# Altium schematic sheet CPU IO.SchDoc: CPU IO
size A2; DrawnBy: UKAYACIK; Engineer: UKAYACIK; DocumentNumber: 7; Revision: B; SheetNumber: 8; SheetTotal: 21
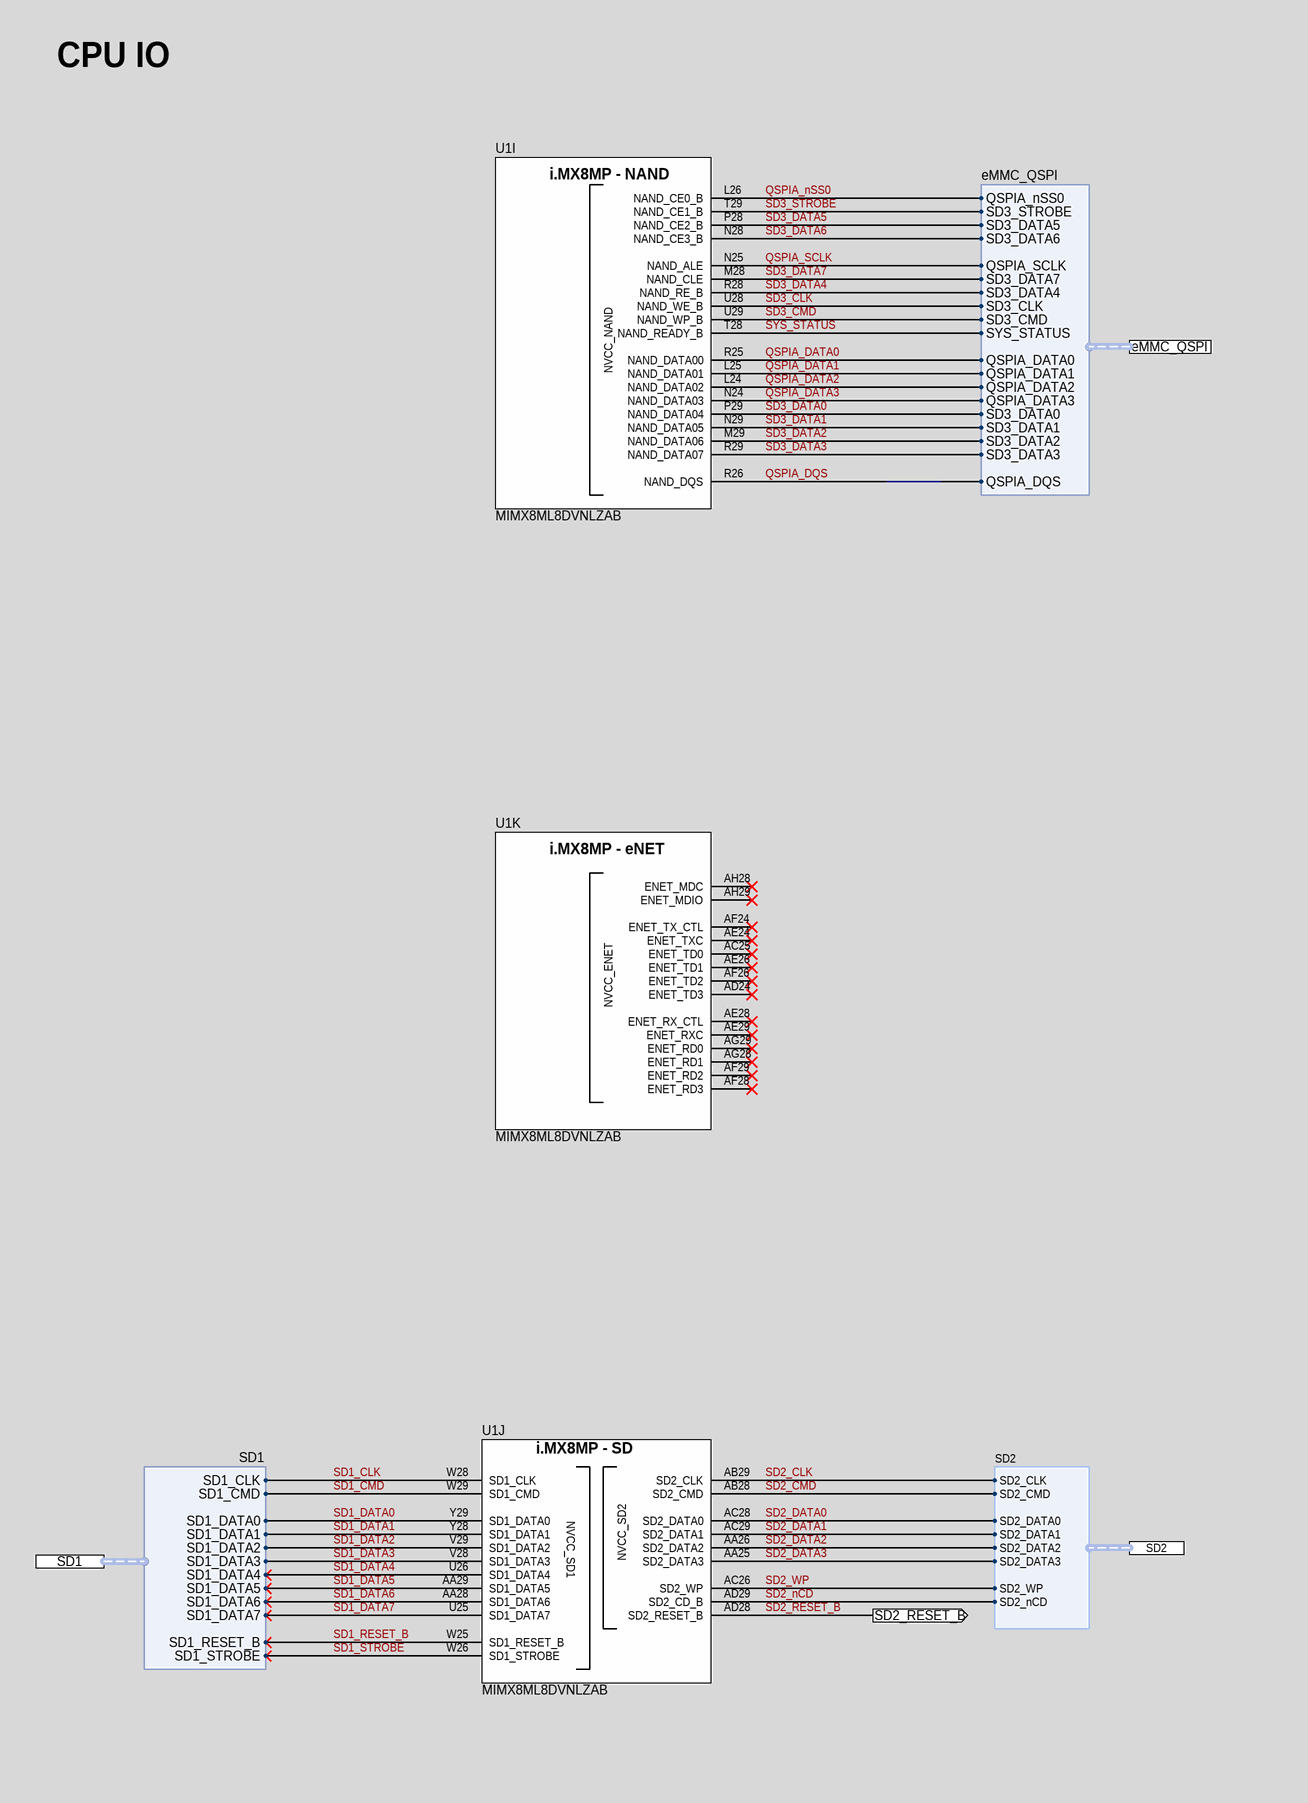
[diagram p0: CPU IO.SchDoc, left]
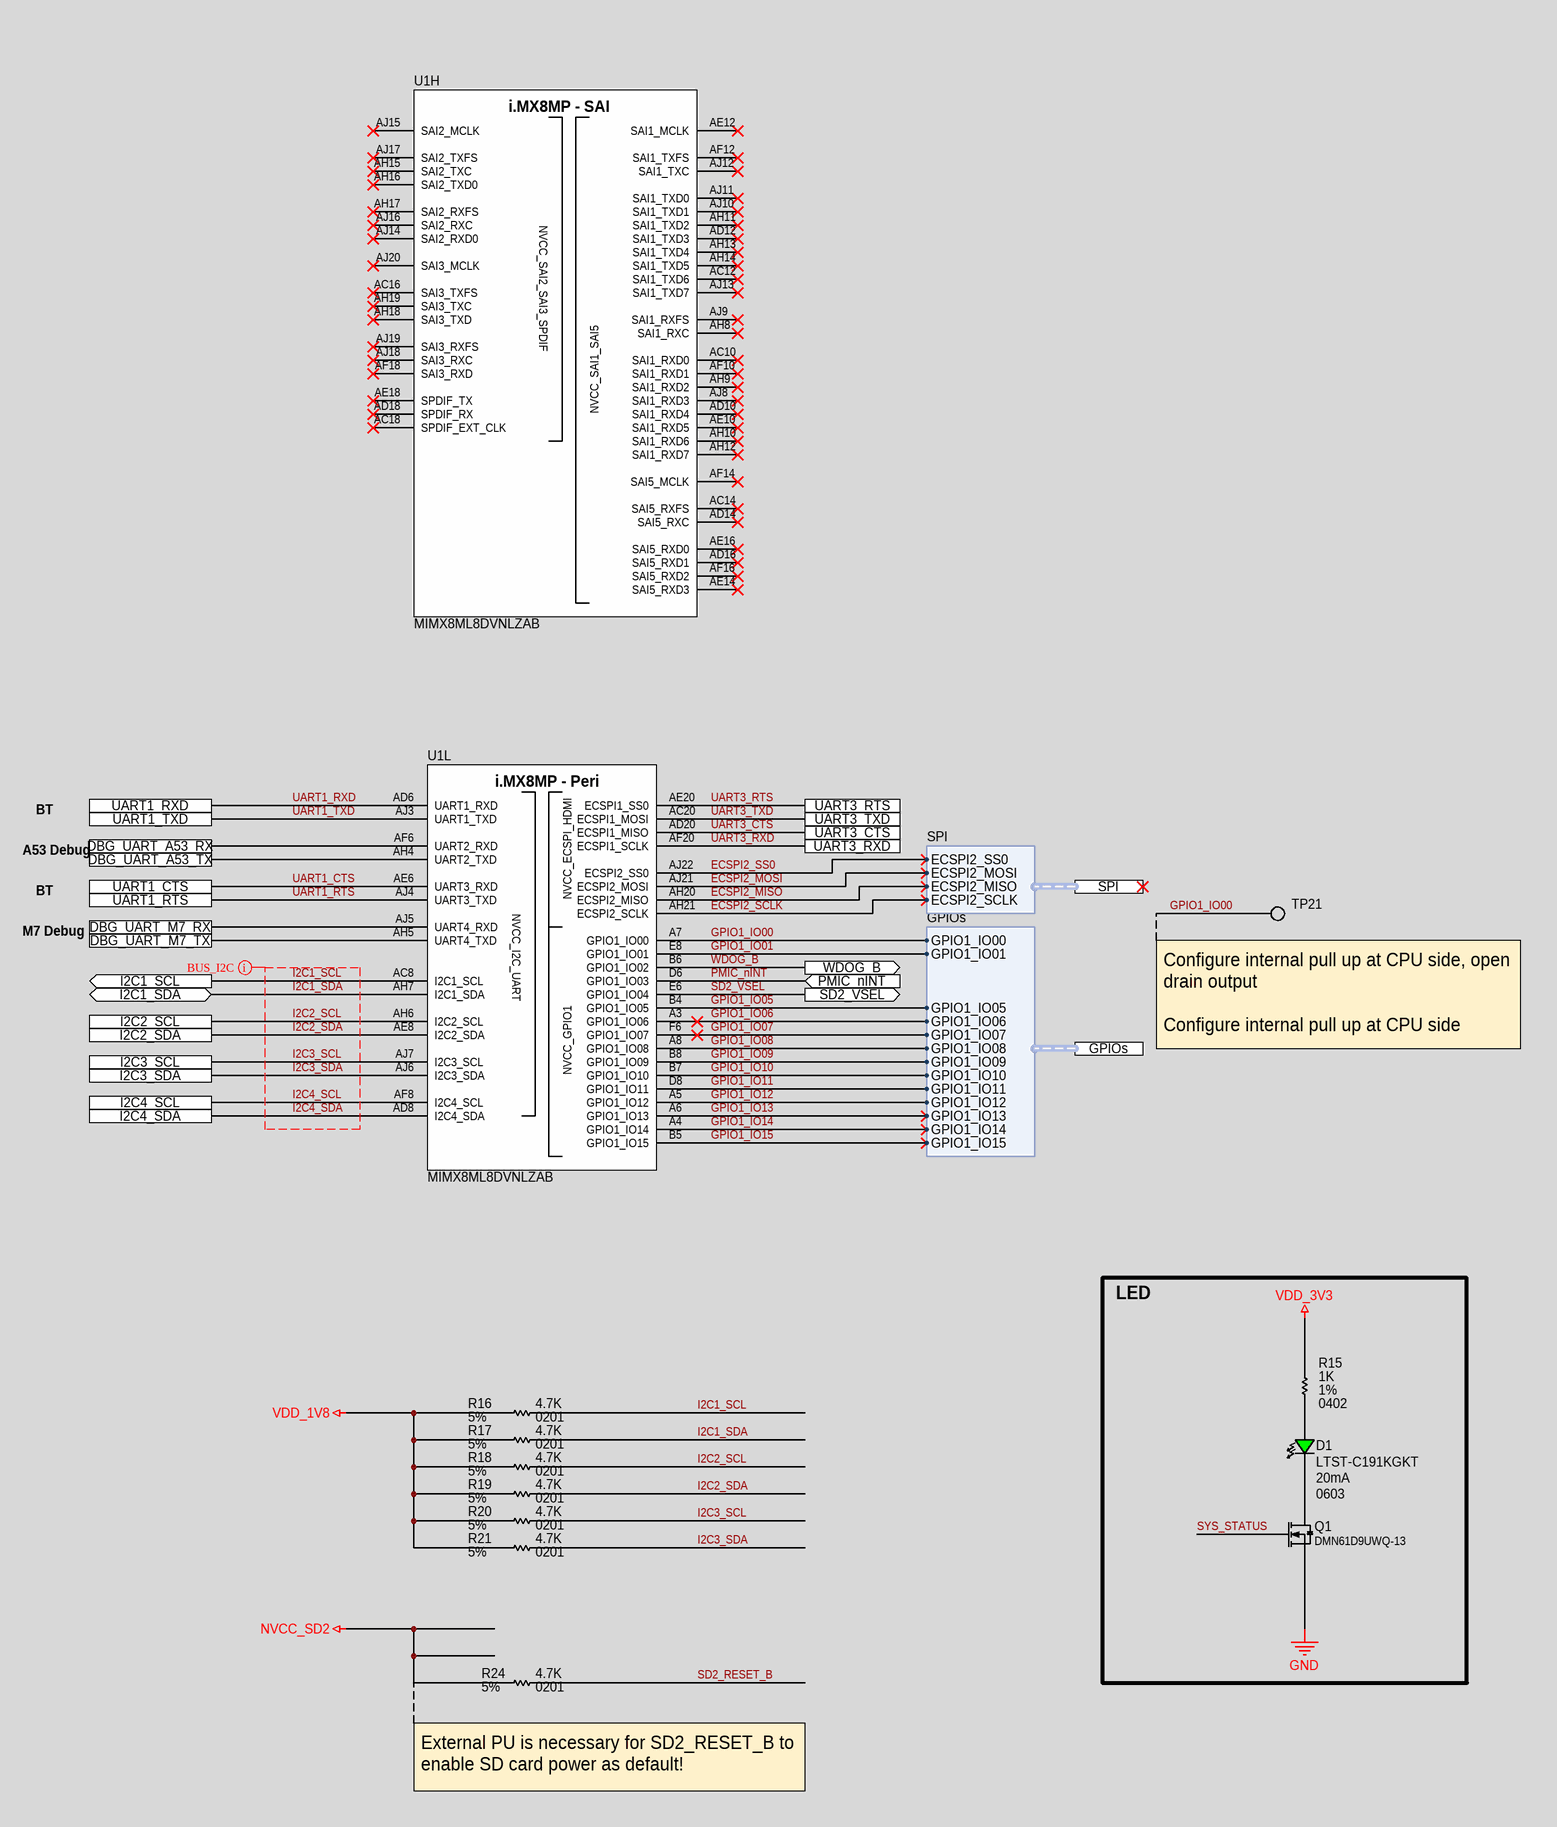
[diagram p1: CPU IO.SchDoc, right]

## Parts
D1  LTST-C191KGKT  Test Current: 20mA  Case/Package: 0603  [LED_0603-GREEN]
Q1  DMN61D9UWQ-13  [SOT-323]
R15  Resistance: 1K  Tolerance: 1%  Case/Package: 0402  [RES_0402_RESC1005X04N]  (hidden comment: ERJ-2RKF1001X)
R16  Tolerance: 5%  Resistance: 4.7K  Case/Package: 0201  [RES_0201_RESC0603X02N]  (hidden comment: RK73B1HTTC472J)
R17  Tolerance: 5%  Resistance: 4.7K  Case/Package: 0201  [RES_0201_RESC0603X02N]  (hidden comment: RK73B1HTTC472J)
R18  Tolerance: 5%  Resistance: 4.7K  Case/Package: 0201  [RES_0201_RESC0603X02N]  (hidden comment: RK73B1HTTC472J)
R19  Tolerance: 5%  Resistance: 4.7K  Case/Package: 0201  [RES_0201_RESC0603X02N]  (hidden comment: RK73B1HTTC472J)
R20  Tolerance: 5%  Resistance: 4.7K  Case/Package: 0201  [RES_0201_RESC0603X02N]  (hidden comment: RK73B1HTTC472J)
R21  Tolerance: 5%  Resistance: 4.7K  Case/Package: 0201  [RES_0201_RESC0603X02N]  (hidden comment: RK73B1HTTC472J)
R24  Tolerance: 5%  Resistance: 4.7K  Case/Package: 0201  [RES_0201_RESC0603X02N]  (hidden comment: RK73B1HTTC472J)
TP21  NO COMPONENT  [TP_PAD_0.5MM_SMD_ROUND]  (value not drawn)  (no BOM)
U1  MIMX8ML8DVNLZAB  [IC_MPU_BGA548C50P29X29_1500X1500X148]  (parts H,I,J,K,L of 15)

## Blocks framed on the sheet
LED: D1 Q1 R15

## Ports
DBG_UART_A53_RX, DBG_UART_A53_TX, DBG_UART_M7_RX, DBG_UART_M7_TX, eMMC_QSPI (harness eMMC_QSPI), GPIOs (harness GPIOs), I2C1_SCL (out), I2C1_SDA (bidir), I2C2_SCL, I2C2_SDA, I2C3_SCL, I2C3_SDA, I2C4_SCL, I2C4_SDA, PMIC_nINT (in), SD1 (harness SD1), SD2 (harness SD2), SD2_RESET_B (out), SD2_VSEL (out), SPI (harness SPI), UART1_CTS, UART1_RTS, UART1_RXD, UART1_TXD, UART3_CTS, UART3_RTS, UART3_RXD, UART3_TXD, WDOG_B (out)

## Harnesses
eMMC_QSPI: SD3_STROBE, SD3_DATA5, SD3_DATA6, SD3_DATA7, SD3_DATA4, SD3_CLK, SD3_CMD, SYS_STATUS, QSPIA_DATA0, QSPIA_DATA1, QSPIA_DATA2, QSPIA_DATA3, QSPIA_nSS0, SD3_DATA0, QSPIA_SCLK, SD3_DATA1, SD3_DATA2, SD3_DATA3, QSPIA_DQS
SD1: SD1_CMD, SD1_DATA0, SD1_DATA1, SD1_DATA2, SD1_DATA3, SD1_DATA4, SD1_DATA6, SD1_DATA7, SD1_RESET_B, SD1_STROBE, SD1_CLK, SD1_DATA5
GPIOs: GPIO1_IO00, GPIO1_IO01, GPIO1_IO05, GPIO1_IO06, GPIO1_IO07, GPIO1_IO08, GPIO1_IO09, GPIO1_IO10, GPIO1_IO11, GPIO1_IO12, GPIO1_IO13, GPIO1_IO14, GPIO1_IO15
SPI: ECSPI2_SS0, ECSPI2_MOSI, ECSPI2_MISO, ECSPI2_SCLK
SD2: SD2_CLK, SD2_CMD, SD2_DATA0, SD2_DATA1, SD2_DATA2, SD2_DATA3, SD2_WP, SD2_nCD

## Nets
GND: Q1.S
NVCC_SD2: R24.1
VDD_1V8: R16.1 R17.1 R18.1 R19.1 R20.1 R21.1
VDD_3V3: R15.2
DBG_UART_A53_RX: U1.AF6(UART2_RXD) ; port DBG_UART_A53_RX
DBG_UART_A53_TX: U1.AH4(UART2_TXD) ; port DBG_UART_A53_TX
DBG_UART_M7_RX: U1.AJ5(UART4_RXD) ; port DBG_UART_M7_RX
DBG_UART_M7_TX: U1.AH5(UART4_TXD) ; port DBG_UART_M7_TX
ECSPI2_MISO: U1.AH20(ECSPI2_MISO) ; port SPI.ECSPI2_MISO
ECSPI2_MOSI: U1.AJ21(ECSPI2_MOSI) ; port SPI.ECSPI2_MOSI
ECSPI2_SCLK: U1.AH21(ECSPI2_SCLK) ; port SPI.ECSPI2_SCLK
ECSPI2_SS0: U1.AJ22(ECSPI2_SS0) ; port SPI.ECSPI2_SS0
GPIO1_IO00: TP21.1 U1.A7(GPIO1_IO00) ; port GPIOs.GPIO1_IO00
GPIO1_IO01: U1.E8(GPIO1_IO01) ; port GPIOs.GPIO1_IO01
GPIO1_IO05: U1.B4(GPIO1_IO05) ; port GPIOs.GPIO1_IO05
GPIO1_IO06: U1.A3(GPIO1_IO06) ; port GPIOs.GPIO1_IO06
GPIO1_IO07: U1.F6(GPIO1_IO07) ; port GPIOs.GPIO1_IO07
GPIO1_IO08: U1.A8(GPIO1_IO08) ; port GPIOs.GPIO1_IO08
GPIO1_IO09: U1.B8(GPIO1_IO09) ; port GPIOs.GPIO1_IO09
GPIO1_IO10: U1.B7(GPIO1_IO10) ; port GPIOs.GPIO1_IO10
GPIO1_IO11: U1.D8(GPIO1_IO11) ; port GPIOs.GPIO1_IO11
GPIO1_IO12: U1.A5(GPIO1_IO12) ; port GPIOs.GPIO1_IO12
GPIO1_IO13: U1.A6(GPIO1_IO13) ; port GPIOs.GPIO1_IO13
GPIO1_IO14: U1.A4(GPIO1_IO14) ; port GPIOs.GPIO1_IO14
GPIO1_IO15: U1.B5(GPIO1_IO15) ; port GPIOs.GPIO1_IO15
I2C1_SCL: R16.2 U1.AC8(I2C1_SCL) ; port I2C1_SCL
I2C1_SDA: R17.2 U1.AH7(I2C1_SDA) ; port I2C1_SDA
I2C2_SCL: R18.2 U1.AH6(I2C2_SCL) ; port I2C2_SCL
I2C2_SDA: R19.2 U1.AE8(I2C2_SDA) ; port I2C2_SDA
I2C3_SCL: R20.2 U1.AJ7(I2C3_SCL) ; port I2C3_SCL
I2C3_SDA: R21.2 U1.AJ6(I2C3_SDA) ; port I2C3_SDA
I2C4_SCL: U1.AF8(I2C4_SCL) ; port I2C4_SCL
I2C4_SDA: U1.AD8(I2C4_SDA) ; port I2C4_SDA
PMIC_nINT: U1.D6(GPIO1_IO03) ; port PMIC_nINT
QSPIA_DATA0: U1.R25(NAND_DATA00) ; port eMMC_QSPI.QSPIA_DATA0
QSPIA_DATA1: U1.L25(NAND_DATA01) ; port eMMC_QSPI.QSPIA_DATA1
QSPIA_DATA2: U1.L24(NAND_DATA02) ; port eMMC_QSPI.QSPIA_DATA2
QSPIA_DATA3: U1.N24(NAND_DATA03) ; port eMMC_QSPI.QSPIA_DATA3
QSPIA_DQS: U1.R26(NAND_DQS) ; port eMMC_QSPI.QSPIA_DQS
QSPIA_nSS0: U1.L26(NAND_CE0_B) ; port eMMC_QSPI.QSPIA_nSS0
QSPIA_SCLK: U1.N25(NAND_ALE) ; port eMMC_QSPI.QSPIA_SCLK
SD1_CLK: U1.W28(SD1_CLK) ; port SD1.SD1_CLK
SD1_CMD: U1.W29(SD1_CMD) ; port SD1.SD1_CMD
SD1_DATA0: U1.Y29(SD1_DATA0) ; port SD1.SD1_DATA0
SD1_DATA1: U1.Y28(SD1_DATA1) ; port SD1.SD1_DATA1
SD1_DATA2: U1.V29(SD1_DATA2) ; port SD1.SD1_DATA2
SD1_DATA3: U1.V28(SD1_DATA3) ; port SD1.SD1_DATA3
SD1_DATA4: U1.U26(SD1_DATA4) ; port SD1.SD1_DATA4
SD1_DATA5: U1.AA29(SD1_DATA5) ; port SD1.SD1_DATA5
SD1_DATA6: U1.AA28(SD1_DATA6) ; port SD1.SD1_DATA6
SD1_DATA7: U1.U25(SD1_DATA7) ; port SD1.SD1_DATA7
SD1_RESET_B: U1.W25(SD1_RESET_B) ; port SD1.SD1_RESET_B
SD1_STROBE: U1.W26(SD1_STROBE) ; port SD1.SD1_STROBE
SD2_CLK: U1.AB29(SD2_CLK) ; port SD2.SD2_CLK
SD2_CMD: U1.AB28(SD2_CMD) ; port SD2.SD2_CMD
SD2_DATA0: U1.AC28(SD2_DATA0) ; port SD2.SD2_DATA0
SD2_DATA1: U1.AC29(SD2_DATA1) ; port SD2.SD2_DATA1
SD2_DATA2: U1.AA26(SD2_DATA2) ; port SD2.SD2_DATA2
SD2_DATA3: U1.AA25(SD2_DATA3) ; port SD2.SD2_DATA3
SD2_nCD: U1.AD29(SD2_CD_B) ; port SD2.SD2_nCD
SD2_RESET_B: R24.2 U1.AD28(SD2_RESET_B) ; port SD2_RESET_B
SD2_VSEL: U1.E6(GPIO1_IO04) ; port SD2_VSEL
SD2_WP: U1.AC26(SD2_WP) ; port SD2.SD2_WP
SD3_CLK: U1.U28(NAND_WE_B) ; port eMMC_QSPI.SD3_CLK
SD3_CMD: U1.U29(NAND_WP_B) ; port eMMC_QSPI.SD3_CMD
SD3_DATA0: U1.P29(NAND_DATA04) ; port eMMC_QSPI.SD3_DATA0
SD3_DATA1: U1.N29(NAND_DATA05) ; port eMMC_QSPI.SD3_DATA1
SD3_DATA2: U1.M29(NAND_DATA06) ; port eMMC_QSPI.SD3_DATA2
SD3_DATA3: U1.R29(NAND_DATA07) ; port eMMC_QSPI.SD3_DATA3
SD3_DATA4: U1.R28(NAND_RE_B) ; port eMMC_QSPI.SD3_DATA4
SD3_DATA5: U1.P28(NAND_CE2_B) ; port eMMC_QSPI.SD3_DATA5
SD3_DATA6: U1.N28(NAND_CE3_B) ; port eMMC_QSPI.SD3_DATA6
SD3_DATA7: U1.M28(NAND_CLE) ; port eMMC_QSPI.SD3_DATA7
SD3_STROBE: U1.T29(NAND_CE1_B) ; port eMMC_QSPI.SD3_STROBE
SYS_STATUS: Q1.G U1.T28(NAND_READY_B) ; port eMMC_QSPI.SYS_STATUS
UART1_CTS: U1.AE6(UART3_RXD) ; port UART1_CTS
UART1_RTS: U1.AJ4(UART3_TXD) ; port UART1_RTS
UART1_RXD: U1.AD6(UART1_RXD) ; port UART1_RXD
UART1_TXD: U1.AJ3(UART1_TXD) ; port UART1_TXD
UART3_CTS: U1.AD20(ECSPI1_MISO) ; port UART3_CTS
UART3_RTS: U1.AE20(ECSPI1_SS0) ; port UART3_RTS
UART3_RXD: U1.AF20(ECSPI1_SCLK) ; port UART3_RXD
UART3_TXD: U1.AC20(ECSPI1_MOSI) ; port UART3_TXD
WDOG_B: U1.B6(GPIO1_IO02) ; port WDOG_B
NetD1_1: D1.1(C) Q1.D
NetD1_2: D1.2(A) R15.1

Not connected (* = marked no-connect by the designer): U1 AC10(SAI1_RXD0)* AC12(SAI1_TXD6)* AC14(SAI5_RXFS)* AC16(SAI3_TXFS)* AC18(SPDIF_EXT_CLK)* AC25(ENET_TD0)* AD10(SAI1_RXD4)* AD12(SAI1_TXD3)* AD14(SAI5_RXC)* AD16(SAI5_RXD1)* AD18(SPDIF_RX)* AD24(ENET_TD3)* AE10(SAI1_RXD5)* AE12(SAI1_MCLK)* AE14(SAI5_RXD3)* AE16(SAI5_RXD0)* AE18(SPDIF_TX)* AE24(ENET_TXC)* AE26(ENET_TD1)* AE28(ENET_RX_CTL)* AE29(ENET_RXC)* AF10(SAI1_RXD1)* AF12(SAI1_TXFS)* AF14(SAI5_MCLK)* AF16(SAI5_RXD2)* AF18(SAI3_RXD)* AF24(ENET_TX_CTL)* AF26(ENET_TD2)* AF28(ENET_RD3)* AF29(ENET_RD2)* AG28(ENET_RD1)* AG29(ENET_RD0)* AH8(SAI1_RXC)* AH9(SAI1_RXD2)* AH10(SAI1_RXD6)* AH11(SAI1_TXD2)* AH12(SAI1_RXD7)* AH13(SAI1_TXD4)* AH14(SAI1_TXD5)* AH15(SAI2_TXC)* AH16(SAI2_TXD0)* AH17(SAI2_RXFS)* AH18(SAI3_TXD)* AH19(SAI3_TXC)* AH28(ENET_MDC)* AH29(ENET_MDIO)* AJ8(SAI1_RXD3)* AJ9(SAI1_RXFS)* AJ10(SAI1_TXD1)* AJ11(SAI1_TXD0)* AJ12(SAI1_TXC)* AJ13(SAI1_TXD7)* AJ14(SAI2_RXD0)* AJ15(SAI2_MCLK)* AJ16(SAI2_RXC)* AJ17(SAI2_TXFS)* AJ18(SAI3_RXC)* AJ19(SAI3_RXFS)* AJ20(SAI3_MCLK)*

## Layout directives
net class I2C: I2C1_SCL, I2C1_SDA, I2C2_SCL, I2C2_SDA, I2C3_SCL, I2C3_SDA, I2C4_SCL, I2C4_SDA

## Notes on the sheet
- CPU IO
- BT
- A53 Debug
- M7 Debug
- (near TP21) Configure internal pull up at CPU side, open drain output
  Configure internal pull up at CPU side
- (near Q1) Blink:  SYS_STATUS
- (near R24) External PU is necessary for SD2_RESET_B to enable SD card power as default!
- PCB Des :
- Approv By :
- Project Title :
- Sheet Title :
- Date :
- Page :
- PCB Version :
- PCB Revision :
- Size :
- A2
- (in symbol IC_MPU_8M_PLUS_MIMX8ML8DVNLZAB, part H) i.MX8MP - SAI
- (in symbol IC_MPU_8M_PLUS_MIMX8ML8DVNLZAB, part I) i.MX8MP - NAND
- (in symbol IC_MPU_8M_PLUS_MIMX8ML8DVNLZAB, part J) i.MX8MP - SD
- (in symbol IC_MPU_8M_PLUS_MIMX8ML8DVNLZAB, part K) i.MX8MP - eNET
- (in symbol IC_MPU_8M_PLUS_MIMX8ML8DVNLZAB, part L) i.MX8MP - Peri; NVCC_GPIO1

## Library data of the parts
D1 = LED_DIO_GREEN_20mA_0603: LTST-C191KGKT Lite-On LED, green, 18-71mcd, 130, 1.9V-2.4V SMD, 0603 1.6x0.8x0.55mm RoHS; Manufacturer: Vishay Lite-On; Lens Color: Colorless; Luminous Intensity: 35mcd; Viewing Angle: 130°; Forward Voltage: 2V; Dominant Wavelength: 571nm; Lens Transparency: Clear; Wavelength: 574nm; Lens Style: Flat,Rectangular,Colorless; Number of LEDs: 1; Max Power Dissipation: 75mW; Lens Size: 0.8mm; Supplier 1: Digi-Key; Manufacturer Part Number: LTST-C191KGKT; RoHS: Yes; Stock 1: 1556161; Pricing 1: 1=0.26, 10=0.143, 100=0.0663, 500=0.0612, 1000=0.04794, 2000=0.04693 (USD); Mount: Surface Mount; Number of Pins: 2; Color: Green; Case Code (Metric): 1608; Case Code (Imperial): 0603; Min Operating Temperature: -55°C; Max Operating Temperature: 85°C; Packaging: Tape and Reel; Series: -; Length: 1.6mm; Width: 0.8mm; Height: 0.65mm; RoHS Compliant: Yes; Lead Free: Lead Free; ComponentLink1URL: https://datasheet.ciiva.com/2109/ltst-c191kgkt-2109973.pdf?src-supplier=Digi-Key; ComponentLink1Description: https://datasheet.ciiva.com/2109/ltst-c191kgkt-2109973.pdf?src-supplier=Digi-Key; Supplier Part Number 1: 160-1446-1-ND
Q1 = TRANS_FET_CHA_N_60V_340mA: N-Channel Enhancement Mode MOSFET 60V 340mA 3-Pin SOT-323 T/R; Manufacturer: Diodes; Continuous Drain Current (ID): 400mA; Rds On Max: 2R; Input Capacitance: 28.5pF; Max Power Dissipation: 440mW; Supplier 1: Digi-Key; Manufacturer Part Number: DMN61D9UWQ-13; RoHS: Yes; Category: MOSFETs; Stock 1: 209235; Pricing 1: 1=0.35, 10=0.259, 100=0.1468, 500=0.0972, 1000=0.07452, 2000=0.0648, 5000=0.05832 (USD); Mount: Surface Mount; Case/Package: SOT-323; Min Operating Temperature: -55°C; Max Operating Temperature: 150°C; Packaging: Cut Tape; Drain to Source Voltage (Vdss): 60V; Series: -; RoHS Compliant: Yes; ComponentLink1URL: https://www.diodes.com/assets/Datasheets/DMN61D9UWQ.pdf?src-supplier=Digi-Key; ComponentLink1Description: https://www.diodes.com/assets/Datasheets/DMN61D9UWQ.pdf?src-supplier=Digi-Key; ComponentLink2URL: https://datasheet.octopart.com/DMN61D9UWQ-13-Diodes-Inc.-datasheet-151210411.pdf?src-supplier=Farnell; ComponentLink2Description: https://datasheet.octopart.com/DMN61D9UWQ-13-Diodes-Inc.-datasheet-151210411.pdf?src-supplier=Farnell; ComponentLink3URL: https://datasheet.octopart.com/DMN61D9UWQ-13-Diodes-Inc.-datasheet-165191130.pdf?src-supplier=Future+Electronics; ComponentLink3Description: https://datasheet.octopart.com/DMN61D9UWQ-13-Diodes-Inc.-datasheet-165191130.pdf?src-supplier=Future+Electronics; Supplier Part Number 1: DMN61D9UWQ-13DICT-ND
R15 = RES_1K_1%_100mW_0402: RES SMD 1K OHM 1% 1/10W 0402; Manufacturer: Panasonic; Temperature Coefficient: 100ppm/°C; Max Power Dissipation: 100mW; Voltage Rating (DC): 50V; Supplier 1: Digi-Key; Manufacturer Part Number: ERJ-2RKF1001X; RoHS: Yes; Category: Chip SMD Resistors; Stock 1: 2367361; Pricing 1: 1=0.1, 10=0.029, 50=0.0162, 100=0.0119, 500=0.00728, 1000=0.00535, 5000=0.00384 (USD); Mount: Surface Mount; Number of Pins: 2; Case Code (Imperial): 0402; Case Code (Metric): 1005; Contact Plating: Tin; Min Operating Temperature: -55°C; Max Operating Temperature: 155°C; Packaging: Tape and Reel; Number of Terminations: 2; Features: Automotive AEC-Q200; Voltage Rating: 50V; Power Rating: 100mW; Package Quantity: 1; Termination: SMD/SMT; Resistor Type: Thick Film; Series: ERJ; Resistance Tolerance: 1%; Construction: Rectangular; Technology: THICK FILM; Length: 1mm; Width: 0.5mm; Height: 0.35mm; Depth: 0.5mm; Lead Free: Lead Free; RoHS Compliant: Yes; Reach SVHC Compliant: Yes; Military Standard: Not; Supplier Part Number 1: P1.00KLCT-ND
R16-R21 R24 = RES_4.7K_5%_50mW_0201: Res Thick Film 0201 4.7K Ohm 5% 0.05W(1/20W) ±200ppm/C Pad SMD Automotive T/R; Manufacturer: KOA Speer; Power Rating: 50mW; Voltage Rating: 25V; Temperature Coefficient: 200ppm/°C; Supplier 1: Digikey; Manufacturer Part Number: RK73B1HTTC472J; RoHS: Yes; Category: Chip SMD Resistors; Stock 1: 410528; Pricing 1: 1=0.1, 10=0.033, 50=0.021, 100=0.0177, 500=0.01224, 1000=0.0106, 5000=0.00782 (USD); Case Code (Imperial): 0201; Case Code (Metric): 0603; Min Operating Temperature: -55°C; Max Operating Temperature: 125°C; Packaging: Tape and Reel; Termination: SMD/SMT; Voltage Rating (DC): 25V; Series: RK73B; Construction: Rectangular; Length: 0.6mm; Depth: 0.3mm; Military Standard: Not; Lead Free: Lead Free; RoHS Compliant: Yes; ComponentLink1URL: https://datasheet.ciiva.com/5556/rk73b-5556381.pdf?src-supplier=Mouser; ComponentLink1Description: https://datasheet.ciiva.com/5556/rk73b-5556381.pdf?src-supplier=Mouser; Supplier Part Number 1: 2019-RK73B1HTTC472JDKR-ND
TP21 = TP_PAD_SMD_SMALL: Test Point, SMD pad, round, 1.5mm, 1.6mm, 3mm diameter
U1 = IC_MPU_8M_PLUS_MIMX8ML8DVNLZAB: i.MX 8M Plus, Consumer, / TRAY TRAY MULTIPLE DP BAKEABLE RoHS Compliant: Yes; Manufacturer: NXP Semiconductors; Supplier 1: Arrow Electronics; Manufacturer Part Number: MIMX8ML8DVNLZAB; RoHS: Yes; Category: Microprocessors; Stock 1: 1036; Pricing 1: 1=54.8, 5=52.24, 10=44.19, 25=42.8, 50=39.95, 100=31.83 (USD); Supplier Part Number 1: MIMX8ML8DVNLZAB